# EAGLE design Adafruit DS3502 (EAGLE 9.4.2)
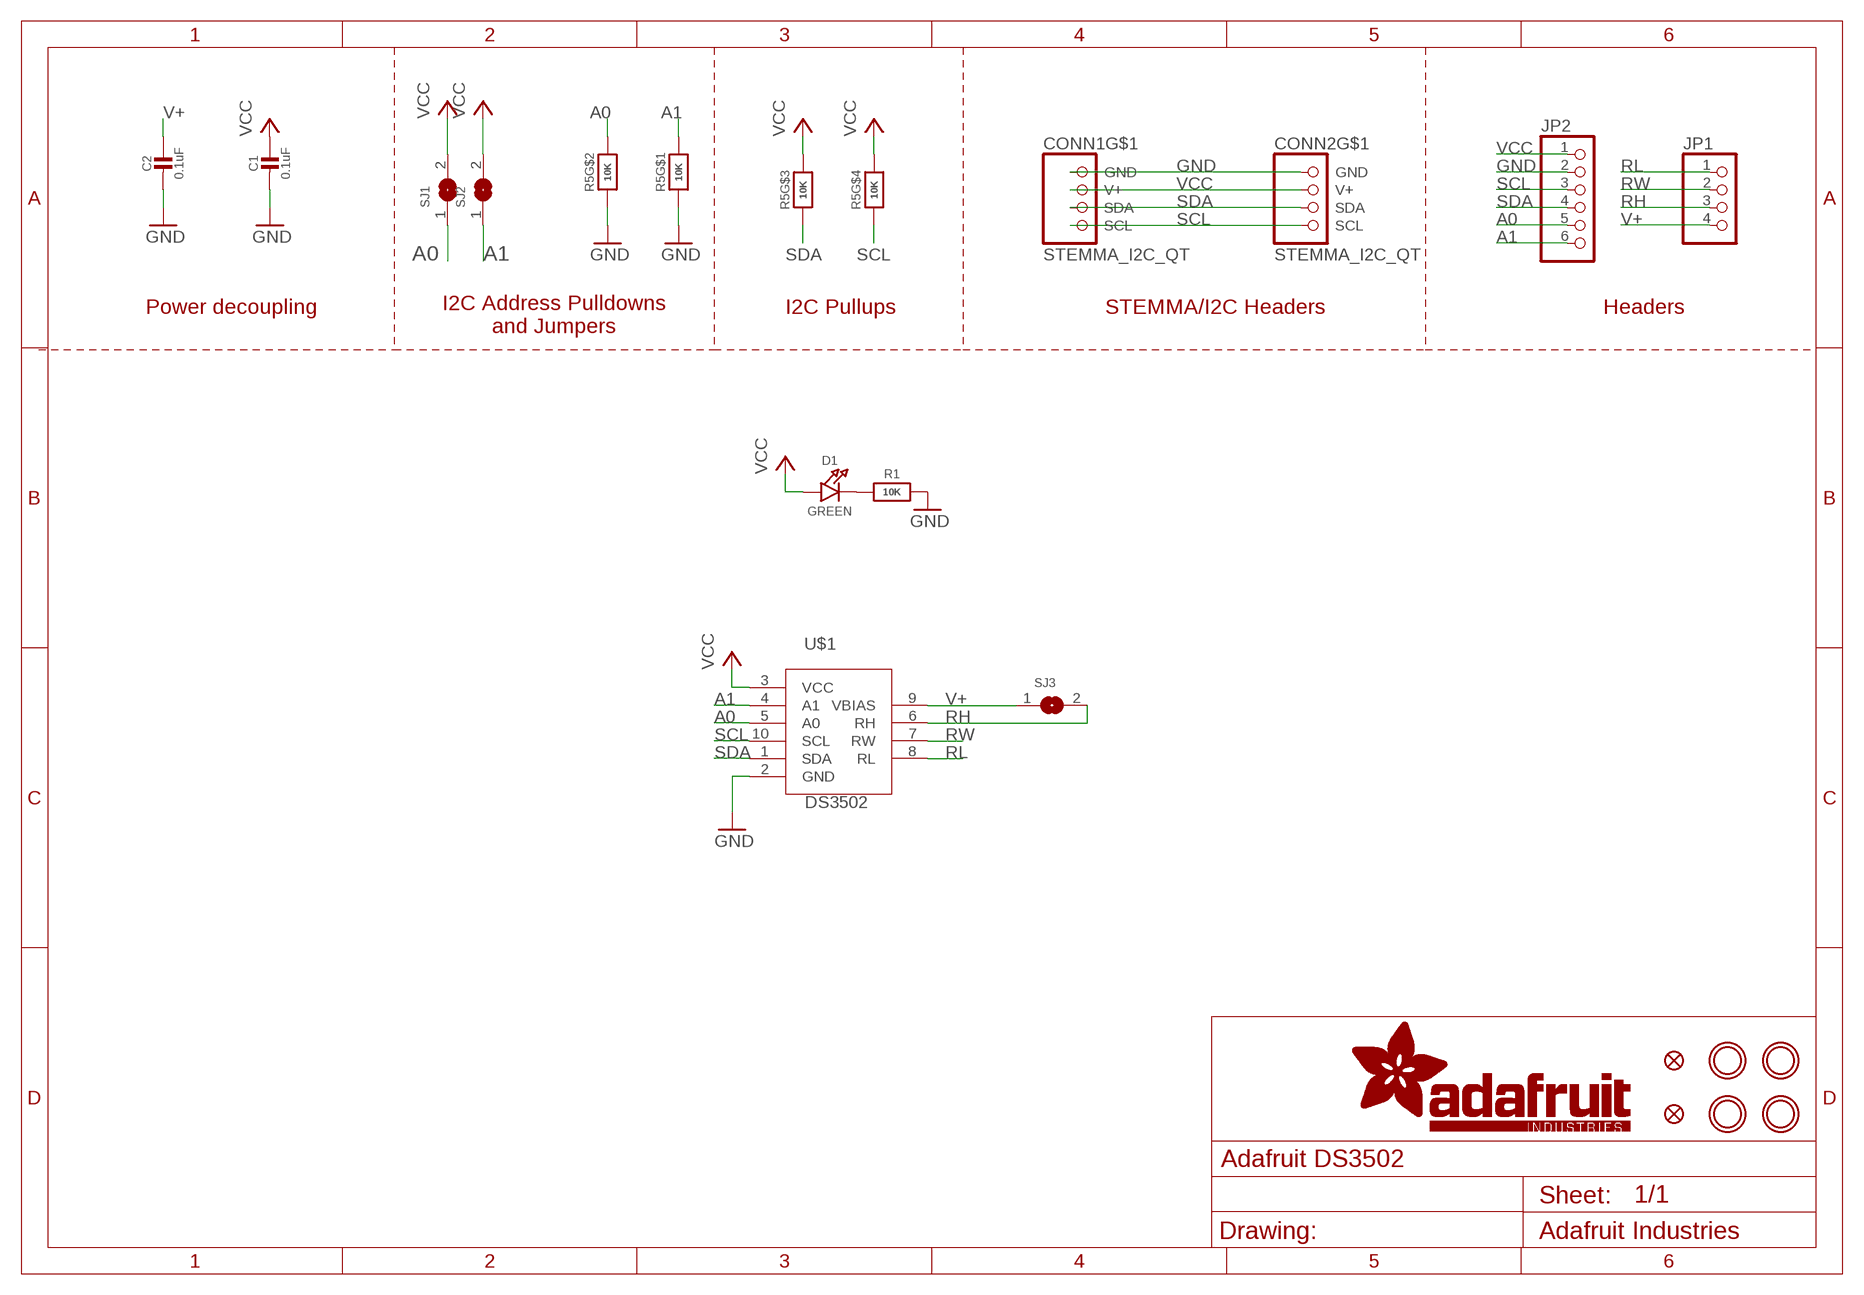
[diagram p0: schematic, sheet 1]

## Parts
C1  0.1uF  CAP_CERAMIC0603_NO  [0603-NO]
C2  0.1uF  CAP_CERAMIC0603_NO  [0603-NO]
CONN1  STEMMA_I2C_QT  [JST_SH4]
CONN2  STEMMA_I2C_QT  [JST_SH4]
D1  GREEN  LED0603_NOOUTLINE  [CHIPLED_0603_NOOUTLINE]
FID1  FIDUCIAL_1MM  [FIDUCIAL_1MM]
FID2  FIDUCIAL_1MM  [FIDUCIAL_1MM]
JP1  HEADER-1X4ROUND  [1X04_ROUND]
JP2  HEADER-1X6ROUND  [1X06_ROUND]
R1  10K  RESISTOR_0603_NOOUT  [0603-NO]
R5  10K  RESISTOR_4PACK  [RESPACK_4X0603]
SJ1  SOLDERJUMPER  [SOLDERJUMPER_ARROW_NOPASTE]
SJ2  SOLDERJUMPER  [SOLDERJUMPER_ARROW_NOPASTE]
SJ3  SOLDERJUMPERCLOSED  [SOLDERJUMPER_CLOSEDWIRE]
U$1  DS3502  [MSOP10]
U$2  MOUNTINGHOLE2.5  [MOUNTINGHOLE_2.5_PLATED]
U$3  MOUNTINGHOLE2.5  [MOUNTINGHOLE_2.5_PLATED]
U$6  MOUNTINGHOLE2.5  [MOUNTINGHOLE_2.5_PLATED]
U$7  MOUNTINGHOLE2.5  [MOUNTINGHOLE_2.5_PLATED]

## Nets
A0: JP2.5 R5.7 SJ1.1 U$1.5(A0)
A1: JP2.6 R5.8 SJ2.1 U$1.4(A1)
GND: C1.2 C2.2 CONN1.1(GND) CONN2.1(GND) JP2.2 R1.2 R5.1 R5.2 U$1.2(GND)
N$2: D1.C R1.1
RH: JP1.3 SJ3.2 U$1.6(RH)
RL: JP1.1 U$1.8(RL)
RW: JP1.2 U$1.7(RW)
SCL: CONN1.4(SCL) CONN2.4(SCL) JP2.3 R5.4 U$1.10(SCL)
SDA: CONN1.3(SDA) CONN2.3(SDA) JP2.4 R5.3 U$1.1(SDA)
V+: C2.1 JP1.4 SJ3.1 U$1.9(VBIAS)
VCC: C1.1 CONN1.2(V+) CONN2.2(V+) D1.A JP2.1 R5.5 R5.6 SJ1.2 SJ2.2 U$1.3(VCC)
Unconnected: CONN1.MT1(MT) CONN1.MT2(MT) CONN2.MT1(MT) CONN2.MT2(MT)

## Notes on the sheet
- Power decoupling
- I2C Address Pulldowns
  and Jumpers
- I2C Pullups | STEMMA/I2C Headers | Headers

## Library data of the parts
C1 C2 = microbuilder:CAP_CERAMIC: Ceramic Capacitors For new designs, use the packages preceded by an '_' character since they are more reliable: The following footprints should be used on most boards: _0402 - Standard footprint for regular board layouts _0603 - Standard footprint for regular board layouts _0805 - Standard footprint for regular board layouts _1206 - Standard footprint for regular board layouts For extremely tight-pitch boards where space is at a premium, the following 'micro-pitch' footprints can be used (smaller pads, no silkscreen outline, etc.): _0402MP - Micro-pitch footprint for very dense/compact boards _0603MP - Micro-pitch footprint for very dense/compact boards _0805MP - Micro-pitch footprint for very dense/compact boards _1206MP - Micro-pitch footprint for very dense/compact boards
CONN1 CONN2 = microbuilder:STEMMA_I2C
D1 = microbuilder:LED: LED 0603 - 0603 Surface Mount Package 2mA: Green LED - Low Power (3.9mcd, 2ma, 1.7Vf) - Digikey: 475-2709-2-ND Orange LED - Low Power (9.8mcd, 2ma, 1.8Vf) - Digikey: 475-1194-2-ND Red LED - Low Power (5mcd, 2ma, 1.8Vf) - Digikey: 475-1195-2-ND Yellow LED - Low Power (7mcd, 2ma, 1.8Vf) - Digikey: 475-1196-2-ND 5mA: Blue LED - Low Power (17mcd, 5ma, 2.9Vf) - Digikey: LNJ937W8CRACT-ND 0805 - 0805 Surface Mount Package 2mA: Red LED (8.8mcd, 2mA, 1.8Vf, Clear) - Low Power [Digikey: 475-2510-1-ND] Green LED (5mcd, 2mA, 1.8Vf, Clear) - Low Power [Digikey: 475-2730-1-ND] Yellow LED (11.3mcd, 2mA, 1.8Vf, Clear) - Low Power [Digikey: 475-2555-1-ND] 20mA: Red LED (104mcd, 20mA, Diffused) - LS R976 [Digikey: 475-1278-6-ND] Red LED (12mcd, 20mA, 2.0Vf, Clear) - APT2012EC [Digikey: 754-1128-1-ND] Green LED (15mcd, 20mA, 2.2Vf, Clear) - APT2012GC [Digikey: 754-1131-1-ND] Orange LED (160mcd, 20mA, 2.1Vf, Clear) - APT2012SECK [Digikey: 754-1130-1-ND] 1206 - 1206 Surface Mount Package Green LED (26mcd, 20mA, Diffused) - LG N971 [Digikey: 475-1407-6-ND] Red LED (15mcd, 20mA, Diffused) - LH N974 [Digikey: 475-1416-6-ND] Cree - Cree High-Power Surface Mount LEDs XPEBWT-L1-0000-00D50 - White 111lm 350mA 2.9Vf 6200K 110° XTEAWT-00-0000-00000LEE3 - White 114lm 350mA 2.85Vf 5000K 115° Everlight - Everlight 45-21 Series Surface Mount LEDs 45-21/QK2C-B2832AC2CB2/2T - Warm White 2000mcd 20mA 3.25Vf 3050K 120° 45-21/LK2C-B38452C4CB2/2T - Nuetral White 2000mcd 20mA 3.25Vf 4150K 120° 45-21/LK2C-B50634C6CB2/2T - Cold White 2200mcd 20mA 3.25Vf 5650K 120° PLCC2 Reverse Mount LS T77K-J1L2-1-0-2-R18-Z - Red 11.25mcd 2mA 1.8Vf 630nm 120° LO T77K-L1M2-24-Z - Orange 19.6mcd 2mA 1.8Vf 606nm 120° LY T77K-K2M1-26-Z - Yellow 15.7mcd 2mA 1.8Vf 587nm 120°
FID1 FID2 = microbuilder:FIDUCIAL: Fiducial Alignment Points Various fiducial points for machine vision alignment.; BOM: EXCLUDE
JP1 = microbuilder:HEADER-1X4: PIN HEADER
JP2 = microbuilder:HEADER-1X6: PIN HEADER
R1 = microbuilder:RESISTOR: Resistors For new designs, use the packages preceded by an '_' character since they are more reliable: The following footprints should be used on most boards: _0402 - Standard footprint for regular board layouts _0603 - Standard footprint for regular board layouts _0805 - Standard footprint for regular board layouts _1206 - Standard footprint for regular board layouts For extremely tight-pitch boards where space is at a premium, the following 'micro-pitch' footprints can be used (smaller pads, no silkscreen outline, etc.): _0402MP - Micro-pitch footprint for very dense/compact boards _0603MP - Micro-pitch footprint for very dense/compact boards _0805MP - Micro-pitch footprint for very dense/compact boards _1206MP - Micro-pitch footprint for very dense/compact boards
R5 = microbuilder:RESISTOR_4PACK: Resistor Packs (4 resistors) 4 x 0603 10K 1/16W - Digikey: YC164J-10KCT-ND
SJ1 SJ2 = microbuilder:SOLDERJUMPER: SMD Solder JUMPER Solder the two pads together to create a connection, or remove the solder to break it. REFLOW - Use this footprint for solder paste and reflow ovens. WAVE - Use this footprint for hand-soldering (larger pads). CLOSED - Has a trace between the two pads to ensure it is closed by default. The trace needs to be cut to disable the jumper, and can be closed again by creating a solder bridge between the two pads.; BOM: EXCLUDE
SJ3 = microbuilder:SOLDERJUMPER: SMD Solder JUMPER Solder the two pads together to create a connection, or remove the solder to break it. REFLOW - Use this footprint for solder paste and reflow ovens. WAVE - Use this footprint for hand-soldering (larger pads). CLOSED - Has a trace between the two pads to ensure it is closed by default. The trace needs to be cut to disable the jumper, and can be closed again by creating a solder bridge between the two pads.
U$1 = microbuilder:DS3502
U$2 U$3 U$6 U$7 = microbuilder:MOUNTINGHOLE: Mounting Hole For #2 screws (0.086"/2.18mm width, 0.094"/2.4mm hole) use 2.5mm; BOM: EXCLUDE

## Board
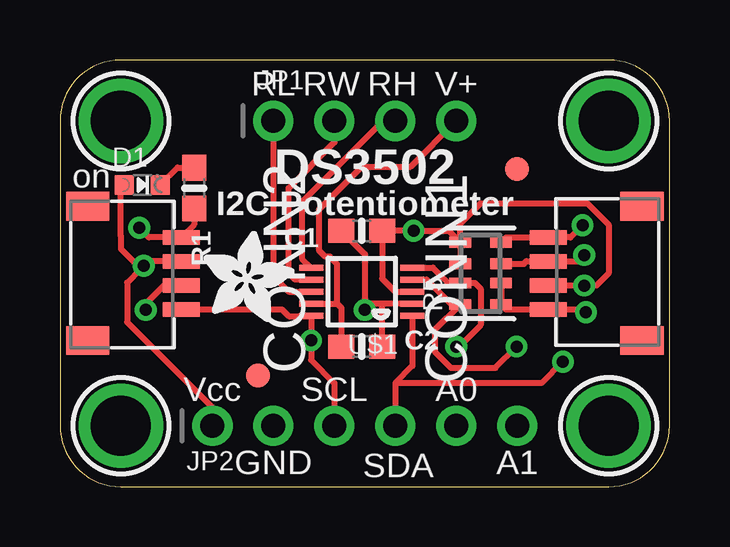
[diagram p1: board, top side]
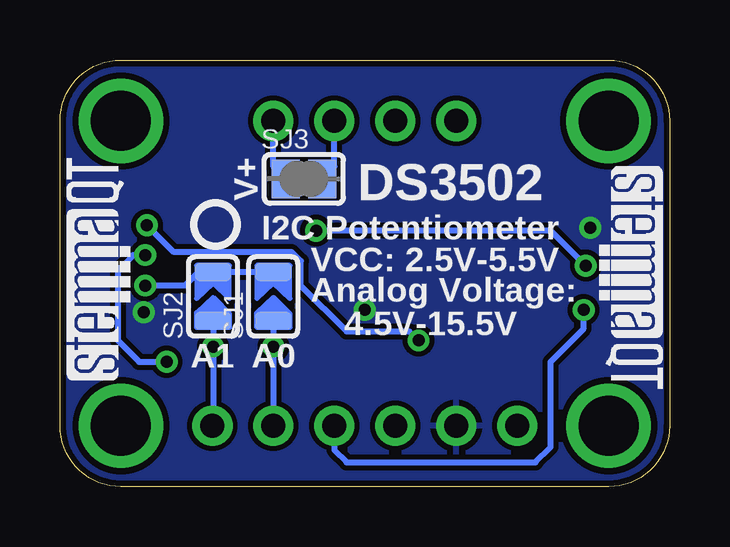
[diagram p2: board, bottom side, seen from below]

Size 25.4 x 17.78 mm. Coordinates in mm from the lower left corner, seen from the top.
Outline: 0,15.24 0,2.54 arc90 2.54,0 22.86,0 arc90 25.4,2.54 25.4,15.24 arc90 22.86,17.78 2.54,17.78 arc90 0,15.24
Copper layers (1*16): Top 0.035mm / dielectric 1.5mm / Bottom 0.035mm
Design rules "adafruit 88": minimum track width 8mil, minimum drill 15.5mil, track to track 8mil, track to pad 8mil, pad to pad 8mil, via to via 8mil, smd to smd 8mil, copper to edge 10mil, drill to drill 8mil, minimum pad ring 10mil, minimum via ring 8mil, stop-mask expansion 2mil, vias tented up to drill 20mil, thermal gap 10mil

### Footprints (pad centres in the part's own frame; a part is rotated, then mirrored left to right if it is on the bottom)
0603-NO = smd 1.075 x 1: 1 -0.85,0; 2 0.85,0
JST_SH4 = smd 0.6 x 1.55: 1 -1.5,2.514; 2 -0.5,2.514; 3 0.5,2.514; 4 1.5,2.514 | smd 1.2 x 1.8: MT1 -2.8,-1.386; MT2 2.8,-1.386
CHIPLED_0603_NOOUTLINE = smd 0.8 x 0.8: A 0,-0.75; C 0,0.75
FIDUCIAL_1MM = smd 1 x 1: 1 0,0
1X04_ROUND = drill 1 pad 1.676: 1 -3.81,0; 2 -1.27,0; 3 1.27,0; 4 3.81,0
1X06_ROUND = drill 1 pad 1.676: 1 -6.35,0; 2 -3.81,0; 3 -1.27,0; 4 1.27,0; 5 3.81,0; 6 6.35,0
RESPACK_4X0603 = smd 0.45 x 0.9: 1 -1.3,-0.85; 2 -0.4,-0.85; 3 0.4,-0.85; 4 1.3,-0.85; 5 1.3,0.85; 6 0.4,0.85; 7 -0.4,0.85; 8 -1.3,0.85
SOLDERJUMPER_ARROW_NOPASTE = smd 0.762 x 1.524: 1 -1.016,0; 2 1.016,0
SOLDERJUMPER_CLOSEDWIRE = smd 1.168 x 1.6: 1 -0.762,0; 2 0.762,0 | smd 0.635 x 0.203: WIRE 0,0
MSOP10 = smd 0.25 x 1: 1 -1,-2.113; 2 -0.5,-2.113; 3 0,-2.113; 4 0.5,-2.113; 5 1,-2.113; 6 1,2.113; 7 0.5,2.113; 8 0,2.113; 9 -0.5,2.113; 10 -1,2.113
MOUNTINGHOLE_2.5_PLATED = drill 2.5 pad 3.2: P$1 0,0

### Placement (x,y rotation side)
C1  12.57,10.67 180 top
C2  12.57,5.84 0 top
CONN1  22.86,8.89 90 top
CONN2  2.54,8.89 270 top
D1  3.43,12.57 270 top
FID1  8.26,4.64 0 top
FID2  19.05,13.25 0 top
JP1  12.7,15.24 0 top
JP2  12.7,2.54 0 top
R1  5.59,12.45 270 top
R5  17.53,8.89 90 top
SJ1  16.51,7.92 90 bottom
SJ2  19.02,7.92 90 bottom
SJ3  15.24,12.83 0 bottom
U$1  12.57,8.13 90 top
U$2  2.54,15.24 0 top
U$3  22.86,15.24 0 top
U$5  [KATTNI_STOP]  12.57,3.68 0 bottom
U$6  2.54,2.54 0 top
U$7  22.86,2.54 0 top
U$8  [ADAFRUIT_3.5MM]  5.97,6.86 0 top
U$9  [PCBFEAT-REV-040]  18.92,10.92 0 bottom
U$10  [STEMMAQT]  22.48,4.45 90 bottom
U$11  [STEMMAQT]  2.92,13.34 270 bottom

### Tracks (layer width: path | path; a pad name or v marks a point on that pad's centre or on a via)
A0  (via drill 0.5)
  Top 0.254: U$1.5 15.53,9.13 15.77,8.89 15.77,8.87 16.15,8.49 R5.7 17.29,8.49 17.53,8.26 17.53,6.73 16.64,5.84 v16.51,5.84
  Bottom 0.254: SJ1.1 v16.51,5.84 JP2.5
A1  (via drill 0.5)
  Top 0.254: U$1.4 15.28,8.63 16.41,7.49 16.58,7.49 R5.8 15.62,6.54 15.62,5.62 16.29,4.95 18.14,4.95 v19.02,5.84
  Bottom 0.254: SJ2.1 v19.02,5.84 19.02,2.56 JP2.6
GND  (via drill 0.5)
  Top 0.254: U$1.2 13.33,7.63 | 13.33,7.63 12.7,7.63 v12.7,7.37 12.7,9.69 C1.2 | C2.2 13.42,7.53 13.33,7.63 | v3.3,10.79 3.71,10.39 CONN2.1 5.59,10.92 R1.2 | R5.2 R5.1 18.58,7.39 CONN1.1 21.8,7.39 v21.91,7.27
  pour Bottom: 0,17.78 0,0 25.4,0 25.4,17.78
N$2
  Top 0.254: D1.C 4.9,13.3 R1.1
RH
  Top 0.254: U$1.6 10.08,9.51 10.08,11.86 13.46,15.24 JP1.3
  Bottom 0.254: SJ3.2 13.97,13.34 JP1.3
RL
  Top 0.254: JP1.1 8.89,8.76 9.53,8.13 U$1.8
RW
  Top 0.254: U$1.7 9.79,8.63 9.53,8.89 9.53,12.45 11.43,14.35 JP1.2
SCL  (via drill 0.5)
  Top 0.254: JP2.3 11.43,4.32 10.46,5.29 v10.46,6.1 U$1.10 10.44,7.11 9.53,7.11 9.25,7.39 CONN2.4 | R5.4 18.58,10.39 CONN1.4 21.27,10.39 v21.77,10.9
  Bottom 0.254: v10.46,6.1 10.84,6.48 13.46,6.48 15.37,8.38 15.37,9.4 15.75,9.78 20.66,9.78 v21.77,10.9
SDA  (via drill 0.5)
  Top 0.254: U$1.1 14.69,5.03 13.97,4.32 | 13.97,4.32 JP2.4 | R5.3 19.32,9.29 19.43,9.4 20.34,9.4 CONN1.3 21.58,9.39 v21.84,9.65 | CONN2.3 4.35,8.39 3.58,7.62 v3.58,7.37 | 13.97,4.32 20.07,4.32 v20.95,5.21
  Bottom 0.254: v3.58,7.37 3.58,6.58 4.95,5.21 4.95,1.65 5.59,1.02 13.46,1.02 13.97,1.52 JP2.4 | v21.84,9.65 22.35,9.65 22.99,9.02 22.99,6.1 22.1,5.21 v20.95,5.21
V+
  Top 0.254: U$1.9 11.55,7.63 | C2.1 11.72,7.45 11.55,7.63 | 11.55,7.63 11.55,9.28 11.24,9.58 11.05,9.58 10.79,9.84 10.79,11.56 12.57,13.34 14.61,13.34 JP1.4
  Bottom 0.254: SJ3.1 16.51,13.34 JP1.4
VCC  (via drill 0.5)
  Top 0.254: U$1.3 13.97,8.13 13.42,8.68 C1.1 v14.73,10.67 16.2,10.67 R5.5 | R5.5 R5.6 | CONN2.2 3.67,9.39 v3.49,9.21 3.37,9.08 | 3.37,9.08 2.79,8.51 2.79,6.86 6.35,3.3 JP2.1 | CONN1.2 v21.84,8.38 22.35,8.38 22.86,8.89 22.86,10.92 21.97,11.81 17.53,11.81 16.68,10.96 R5.5 | D1.A 2.52,12.41 2.52,10.47 2.54,10.45 2.54,9.91 3.37,9.08
  Bottom 0.254: v21.84,8.38 20.19,8.38 19.63,8.94 SJ2.2 SJ1.2 | v3.49,9.21 4.95,10.67 v14.73,10.67

### Text on the board
tPlace: RL | RW | RH | V+ | DS3502 | on | I2C Potentiometer | Vcc | SCL | A0 | GND | SDA | A1
bPlace: DS3502 | V+ | I2C Potentiometer | VCC: 2.5V-5.5V | Analog Voltage: | 4.5V-15.5V | A0 | A1